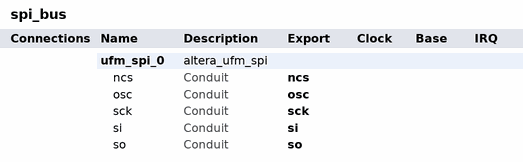
[diagram p0: system contents]
# Platform Designer (Qsys) system spi_bus, MAX V 5M570ZF256C5
# Parameters at their usual value, and those the tool derives, are not listed.
package require -exact qsys 22.1
create_system spi_bus
set_project_property DEVICE_FAMILY {MAX V}
set_project_property DEVICE 5M570ZF256C5

add_instance ufm_spi_0 altera_ufm_spi 22.1
set_instance_property ufm_spi_0 AUTO_EXPORT true
set_instance_parameter_value ufm_spi_0 ACCESS_MODE READ_WRITE
set_instance_parameter_value ufm_spi_0 BYTE_OF_PAGE_WRITE 8
set_instance_parameter_value ufm_spi_0 CBX_AUTO_BLACKBOX ALL
set_instance_parameter_value ufm_spi_0 CONFIG_MODE BASE
set_instance_parameter_value ufm_spi_0 GUI_ERASE_TIME 500000
set_instance_parameter_value ufm_spi_0 GUI_MEM_INIT {Initialize blank memory}
set_instance_parameter_value ufm_spi_0 GUI_OSC_FREQUENCY 5.56
set_instance_parameter_value ufm_spi_0 GUI_PROGRAM_TIME 1600
set_instance_parameter_value ufm_spi_0 OSCENA_CHECK false
set_instance_parameter_value ufm_spi_0 OSC_CHECK true
set_instance_parameter_value ufm_spi_0 WIDTH_UFM_ADDRESS 9

# exported interfaces
add_interface ncs conduit end
set_interface_property ncs EXPORT_OF ufm_spi_0.ncs
add_interface osc conduit end
set_interface_property osc EXPORT_OF ufm_spi_0.osc
add_interface sck conduit end
set_interface_property sck EXPORT_OF ufm_spi_0.sck
add_interface si conduit end
set_interface_property si EXPORT_OF ufm_spi_0.si
add_interface so conduit end
set_interface_property so EXPORT_OF ufm_spi_0.so

set_interconnect_requirement {$system} qsys_mm.clockCrossingAdapter HANDSHAKE
set_interconnect_requirement {$system} qsys_mm.enableEccProtection FALSE
set_interconnect_requirement {$system} qsys_mm.insertDefaultSlave FALSE
set_interconnect_requirement {$system} qsys_mm.maxAdditionalLatency 1

save_system spi_bus.qsys
